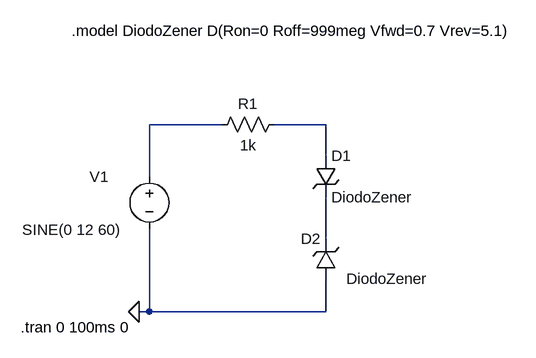
[diagram p0: schematic Ex4.asc]
Ex4.asc, the LTspice schematic file:
Version 4
SHEET 1 880 680
WIRE 160 64 48 64
WIRE 320 64 240 64
WIRE 320 112 320 64
WIRE 48 144 48 64
WIRE 320 240 320 176
WIRE 48 352 48 224
WIRE 48 352 32 352
WIRE 320 352 320 304
WIRE 320 352 48 352
FLAG 32 352 0
SYMBOL voltage 48 128 R0
WINDOW 0 -92 16 Left 2
WINDOW 3 -196 98 Left 2
WINDOW 123 0 0 Left 0
WINDOW 39 0 0 Left 0
SYMATTR InstName V1
SYMATTR Value SINE(0 12 60)
SYMBOL res 256 48 R90
WINDOW 0 0 56 VBottom 2
WINDOW 3 32 56 VTop 2
SYMATTR InstName R1
SYMATTR Value 1k
SYMBOL zener 304 112 R0
SYMATTR InstName D1
SYMATTR Value DiodoZener
SYMBOL zener 336 304 R180
WINDOW 0 24 64 Left 2
WINDOW 3 -142 3 Left 2
SYMATTR InstName D2
SYMATTR Value DiodoZener
TEXT -72 -80 Left 2 !.model DiodoZener D(Ron=0 Roff=999meg Vfwd=0.7 Vrev=5.1)
TEXT -150 376 Left 2 !.tran 0 100ms 0

The netlist it stands for:
* Ex4.asc
V1 N001 0 SINE(0 12 60)
R1 N002 N001 1k
D1 N002 N003 DiodoZener
D2 0 N003 DiodoZener
.model D D
.lib standard.dio
.model DiodoZener D(Ron=0 Roff=999meg Vfwd=0.7 Vrev=5.1)
.tran 0 100ms 0
.backanno
.end